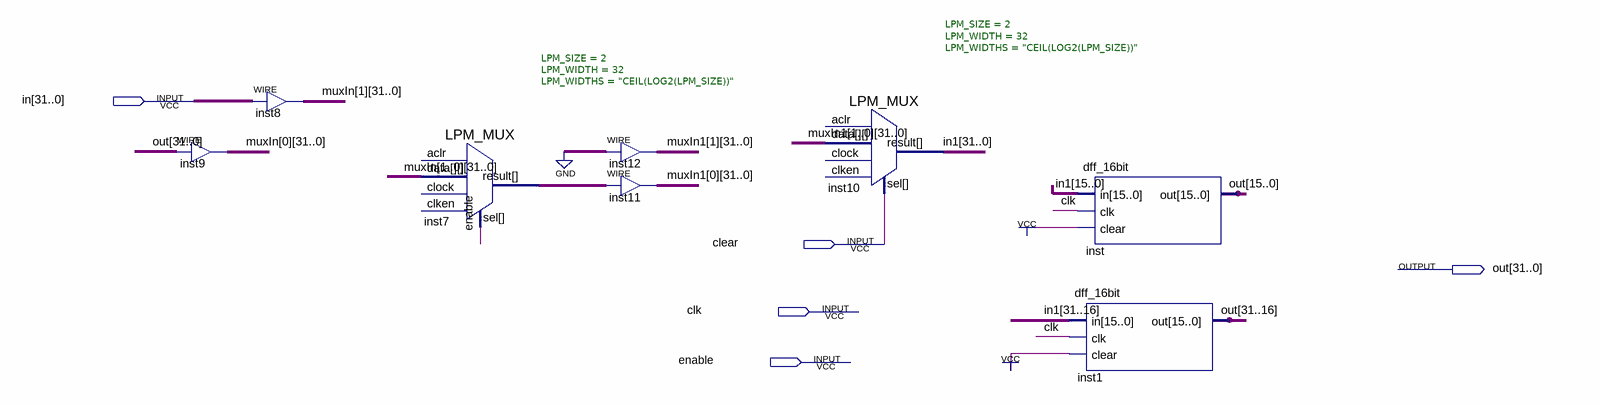
[diagram p0: schematic sheet]
// Quartus schematic dff_32bit.bdf as structural Verilog: 8 symbols, 5 pins
module dff_32bit (
  input  [31:0] in,
  input  clear,
  input  clk,
  input  enable,
  output [31:0] out
);

  wire [31:0] in1, inst7_result, muxIn1_0, muxIn1_1, muxIn_0, muxIn_1;

  assign muxIn_0 = out;  // WIRE inst9
  assign muxIn_1 = in;  // WIRE inst8
  LPM_MUX #(.LPM_SIZE(2), .LPM_WIDTH(32), .LPM_WIDTHS("CEIL(LOG2(LPM_SIZE))")) inst7 (
    .data({muxIn_1, muxIn_0}), .sel(enable), .result(inst7_result));  // open: clock, aclr, clken
  assign muxIn1_1 = {32{1'b0}};  // WIRE inst12
  assign muxIn1_0 = inst7_result;  // WIRE inst11
  LPM_MUX #(.LPM_SIZE(2), .LPM_WIDTH(32), .LPM_WIDTHS("CEIL(LOG2(LPM_SIZE))")) inst10 (
    .data({muxIn1_1, muxIn1_0}), .sel(clear), .result(in1));  // open: clock, aclr, clken
  dff_16bit inst (.in(in1[15:0]), .clk(clk), .clear(1'b1), .out(out[15:0]));
  dff_16bit inst1 (.in(in1[31:16]), .clk(clk), .clear(1'b1), .out(out[31:16]));
endmodule
